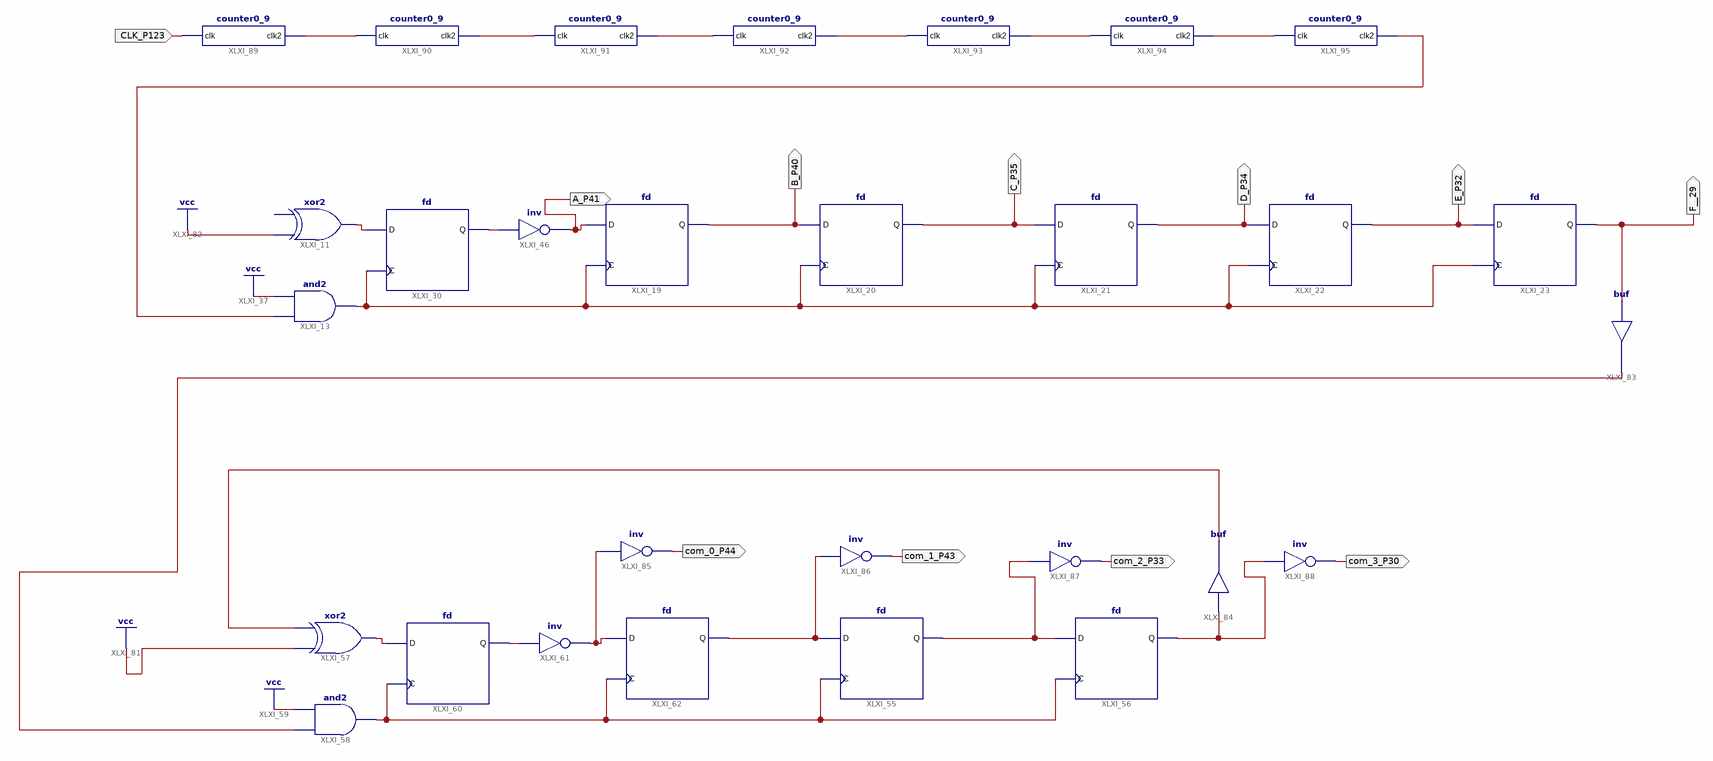
[diagram p0: schematic sheet 1]
// Xilinx ISE schematic lab7t.sch (spartan6) as structural Verilog: 29 symbols, 11 ports
module lab7t (
  input  CLK_P123,
  output B_P40,
  output C_P35,
  output D_P34,
  output E_P32,
  output A_P41,
  output com_0_P44,
  output com_1_P43,
  output com_2_P33,
  output com_3_P30,
  output F__29
);

  wire com0_P44, com1_P43, com2_P33, com3_P30, P123, XLXN_29, XLXN_41, XLXN_87, XLXN_104, XLXN_106, XLXN_109,
       XLXN_110, XLXN_147, XLXN_162, XLXN_163, XLXN_164, XLXN_165, XLXN_166, XLXN_168;

  fd XLXI_22 (.C(XLXN_41), .D(D_P34), .Q(E_P32));
  fd XLXI_20 (.C(XLXN_41), .D(B_P40), .Q(C_P35));
  fd XLXI_21 (.C(XLXN_41), .D(C_P35), .Q(D_P34));
  fd XLXI_23 (.C(XLXN_41), .D(E_P32), .Q(F__29));
  buf XLXI_11 (XLXN_29, 1'b1);  // xor2 open: I1
  and XLXI_13 (XLXN_41, P123, 1'b1);
  fd XLXI_30 (.C(XLXN_41), .D(XLXN_29), .Q(XLXN_87));
  not XLXI_46 (A_P41, XLXN_87);
  fd XLXI_19 (.C(XLXN_41), .D(A_P41), .Q(B_P40));
  fd XLXI_55 (.C(XLXN_109), .D(com1_P43), .Q(com2_P33));
  fd XLXI_56 (.C(XLXN_109), .D(com2_P33), .Q(com3_P30));
  xor XLXI_57 (XLXN_106, 1'b1, XLXN_147);
  and XLXI_58 (XLXN_109, XLXN_104, 1'b1);
  fd XLXI_60 (.C(XLXN_109), .D(XLXN_106), .Q(XLXN_110));
  not XLXI_61 (com0_P44, XLXN_110);
  fd XLXI_62 (.C(XLXN_109), .D(com0_P44), .Q(com1_P43));
  buf XLXI_83 (XLXN_104, F__29);
  buf XLXI_84 (XLXN_147, com3_P30);
  not XLXI_85 (com_0_P44, com0_P44);
  not XLXI_86 (com_1_P43, com1_P43);
  not XLXI_87 (com_2_P33, com2_P33);
  not XLXI_88 (com_3_P30, com3_P30);
  counter0_9 XLXI_89 (.clk(CLK_P123), .clk2(XLXN_162));
  counter0_9 XLXI_90 (.clk(XLXN_162), .clk2(XLXN_163));
  counter0_9 XLXI_91 (.clk(XLXN_163), .clk2(XLXN_164));
  counter0_9 XLXI_92 (.clk(XLXN_164), .clk2(XLXN_165));
  counter0_9 XLXI_93 (.clk(XLXN_165), .clk2(XLXN_166));
  counter0_9 XLXI_94 (.clk(XLXN_166), .clk2(XLXN_168));
  counter0_9 XLXI_95 (.clk(XLXN_168), .clk2(P123));
endmodule
